# EAGLE schematic CCR (EAGLE 7.1.0)
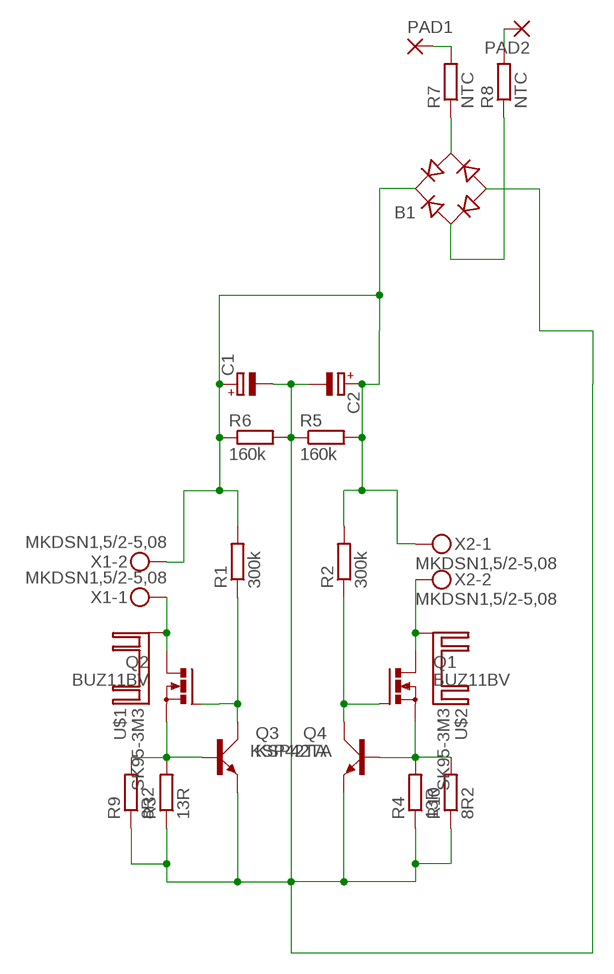
[diagram p0: schematic, sheet 1]

## Parts
B1  RB1A  [RB1A]
C1  CPOL-EUE7.5-18  [E7,5-18]
C2  CPOL-EUE7.5-18  [E7,5-18]
PAD1  3,81/1,4  [3,81/1,4]
PAD2  3,81/1,4  [3,81/1,4]
Q1  BUZ11BV  [TO220BV]
Q2  BUZ11BV  [TO220BV]
Q3  KSP42TA  [SOT-92WIDE]
Q4  KSP42TA  [SOT-92WIDE]
R1  300k  R-EU_0411/12  [0411/12]
R2  300k  R-EU_0411/12  [0411/12]
R3  13R  R-EU_0411/12  [0411/12]
R4  13R  R-EU_0411/12  [0411/12]
R5  160k  R-EU_0207/10  [0207/10]
R6  160k  R-EU_0207/10  [0207/10]
R7  NTC  R-EU_0207/10  [0207/10]
R8  NTC  R-EU_0207/10  [0207/10]
R9  8R2  R-EU_0411/12  [0411/12]
R10  8R2  R-EU_0411/12  [0411/12]
U$1  SK95-3M3  [SK95-3M3]
U$2  SK95-3M3  [SK95-3M3]
X1  MKDSN1,5/2-5,08  [MKDSN1,5/2-5,08]
X2  MKDSN1,5/2-5,08  [MKDSN1,5/2-5,08]

## Nets
GND: B1.- C1.- C2.- Q3.E Q4.E R3.1 R4.1 R5.1 R6.2 R9.1 R10.1
N$3: Q1.S Q4.B R4.2 R10.2
N$4: Q1.D U$2.P$1(K) X2.2
N$5: Q2.D U$1.P$1(K) X1.1
N$6: Q2.S Q3.B R3.2 R9.2
N$7: Q1.G Q4.C R2.1
N$8: Q2.G Q3.C R1.1
N$10: PAD1.1(P) R7.2
N$11: B1.AC1 R8.1
N$13: PAD2.1(P) R8.2
N$14: B1.AC2 R7.1
N$15: B1.+ C1.+ C2.+ R1.2 R2.2 R5.2 R6.1 X1.2 X2.1

## Library data of the parts
B1 = rectifier:RB1A: RECTIFIER 1 A
C1 C2 = rcl:CPOL-EU: POLARIZED CAPACITOR, European symbol
PAD1 PAD2 = wirepad:3,81/1,4: THROUGH-HOLE PAD
Q1 Q2 = transistor-power:BUZ11: N-CHANNEL MOS FET
Q3 Q4 = Namenlos:KSP42TA
R1-R10 = rcl:R-EU_: RESISTOR, European symbol
U$1 U$2 = heatsink:SK95-3M3
X1 X2 = con-phoenix-508:MKDSN1,5/2-5,08: MKDSN 1,5/ 2-5,08 Printklemme Nennstrom: 13,5 A Nennspannung: 250 V Rastermaß: 5,08 mm Polzahl: 2 Anschlussart: Schraubanschluss Montage: Löten Anschlussrichtung Leiter/Platine: 0 ° Artikelnummer: 1729128 Source: http://eshop.phoenixcontact.com .. 1729128.pdf

## Net classes
0 default: clearance 0.205 mm